# Altium project touch_control_pickit_adapter.PrjPcb
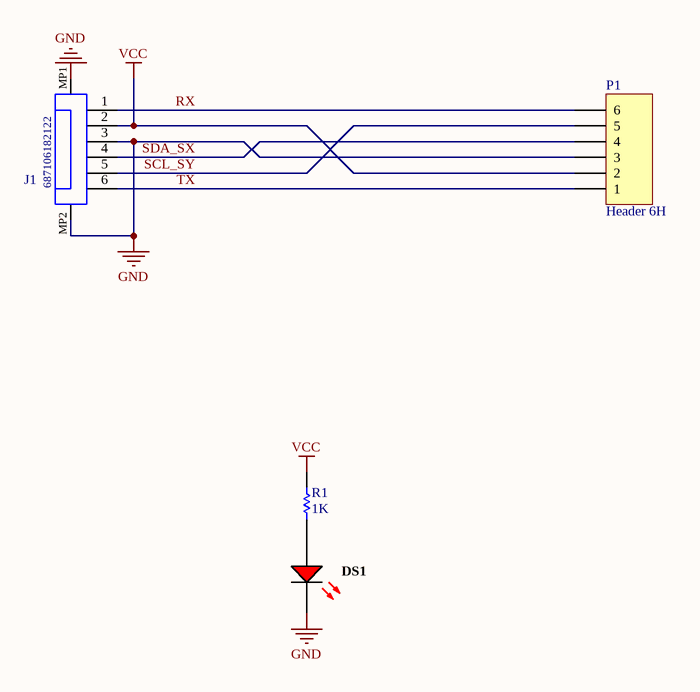
[diagram p0: touch_control_pickit_adapter.SchDoc]
1 sheet, 4 parts. Net scope: global (net labels, ports and power ports of the same name join across sheets).
Board file: touch_control_pickit_adapter..PcbDoc

## Sheet touch_control_pickit_adapter.SchDoc
size A4

### Parts
DS1  APG1608SURKC/T  [KING-LED0603-25-RED_V]  (value not drawn)
J1  687106182122  [687106182122]
P1  Header 6H  [HDR1X6H]
R1  1K  [RESC0603(1608)_N]

### Nets
GND: DS1.2(K) J1.3 J1.MP1 J1.MP2 P1.3
VCC: J1.2 P1.2 R1.1
RX: J1.1 P1.6
SCL_SY: J1.5 P1.5
SDA_SX: J1.4 P1.4
TX: J1.6 P1.1
NetDS1_1: DS1.1(A) R1.2

### Library data of the parts
DS1 = CMP-0404-00004-1: Ultra Thin Hyper Red SMD Chip LED Lamp, 2 to 2.5 V, -40 to 85 degC, Body 1.6 x 0.8 mm, 0.28 mm Thickness, RoHS, Tape and Reel; Manufacturer: Kingbright; Dice: Hyper Red (AlGaInP); IR (Max): 10 uA; Luminous Intensity mcd @ 20 mA (Min.): 55; Lens Type: Water Clear; Viewing Angle: 120; Luminous Intensity mcd @ 20 mA (Typ.): 110; ComponentLink2Description: Datasheet; ComponentLink3URL: http://www.kingbrightusa.com/images/catalog/SPEC/APG1608SURKC-T.pdf; Packing: Tape and Reel; Mounting Technology: Surface Mount; PackageVersion: Rev. V.5A; ComponentLink1Description: Manufacturer URL; ComponentLink2URL: http://www.kingbrightusa.com/images/catalog/SPEC/APG1608SURKC-T.pdf; ComponentLink3Description: Package Specification; PackageDescription: 2-Pin SMT, Body 1.6 x 0.8 mm, 0.28mm Thickness, Red; PackageReference: LED0603-25-RED; DatasheetVersion: Rev. V.5A; Operating Temperature: -40 to 85 degC; PartNumber: APG1608SURKC/T; ComponentLink1URL: http://www.kingbrightusa.com/; Forward Voltage: 2 to 2.5 V; RoHS: TRUE
J1 = CMP-1502-01645-1: SMT ZIF Connectors WR-FPC, Horizontal, Back Locking Dual Contact, pitch 0.5 mm, 6 pins; Manufacturer: Wurth Elektronik; Pitch: 0.5mm; Working Voltage: 50VAC; Withstanding Voltage: 250VAC; Contact Resistance: 30mOhm; Pin Number: 6; Rated Current: 0.5A; Package Reference: 687106182122; Contact Design: BackLockingDualContact; Manufacturer URL: http://www.we-online.de; Datasheet URL: https://katalog.we-online.de/em/datasheet/687106182122.pdf; Publisher: WurthElektronik; Part Number: 687106182122; Mounting Technology: SMT; Orientation: Horizontal; Operating Temperature: -55to85degC; Packaging: TapeandReel
P1 = Header 6H: Header, 6-Pin, Right Angle; LatestRevisionDate: 17-Jul-2002; LatestRevisionNote: Re-released for DXP Platform.; Publisher: Altium Limited
R1 = CMP-1012-00623-1: 10K 0.1W 1% 0603 (1608 Metric)  SMD; Value: 10000.00 Ohm; Case-EIA: 0603; Case-Metric: 1608; Power: 0.1 W; Tolerance: 1 %; Technology: SMT